# Altium project FOB(3).PrjPcb
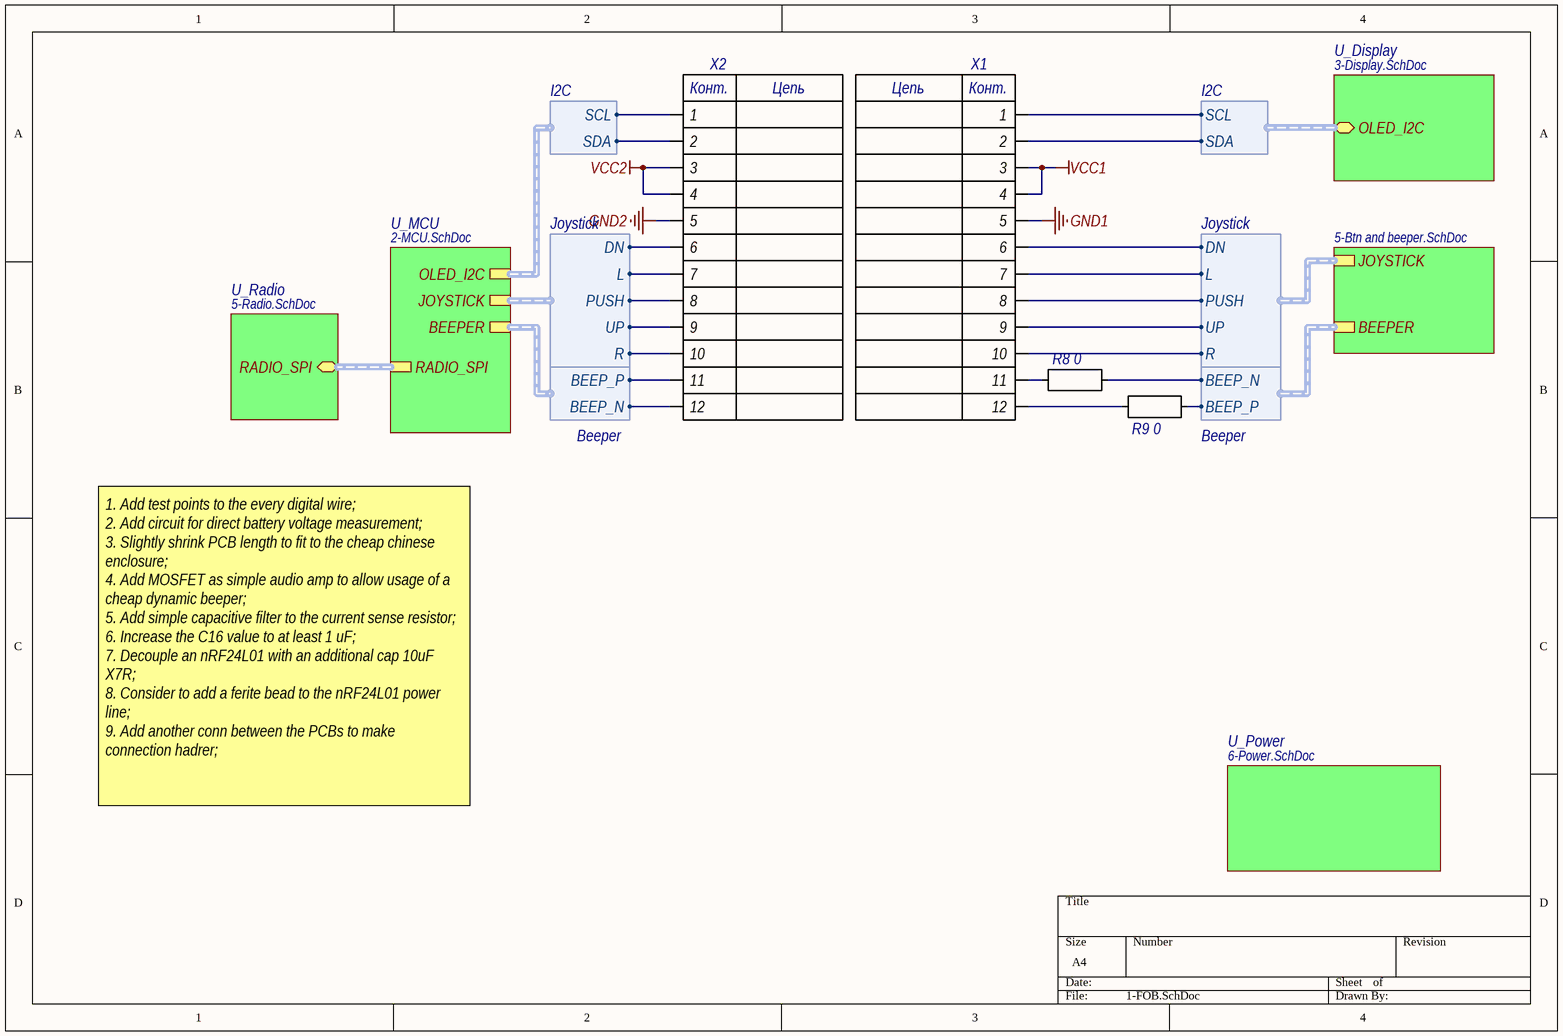
[diagram p0: 1-FOB.SchDoc]
6 sheets, 50 parts. Net scope: hierarchical (ports join the sheet entries above them; power ports are global).
Board file: FOB.PcbDoc
Sheets:
  1-FOB.SchDoc
    U_Radio = 5-Radio.SchDoc
    U_Display = 3-Display.SchDoc
    U_Btn and beeper = 5-Btn and beeper.SchDoc
    U_Power = 6-Power.SchDoc
    U_MCU = 2-MCU.SchDoc

## Sheet 1-FOB.SchDoc
size A4

### Parts
R8  value 0  [CHIP_0402_R]  (hidden comment: Резистор)
R9  value 0  [CHIP_0402_R]  (hidden comment: Резистор)
X1  PLD-12  [PLD1.27-12 SMD]  (value not drawn)
X2  PBD-12  [PBD1.27-12 SMD]  (value not drawn)

### Sub-sheets
U_Btn and beeper = 5-Btn and beeper.SchDoc: JOYSTICK (harness Joystick), BEEPER (harness Beeper)
U_Display = 3-Display.SchDoc: OLED_I2C (harness I2C)
U_MCU = 2-MCU.SchDoc: JOYSTICK (harness Joystick), BEEPER (harness Beeper), OLED_I2C (harness I2C), RADIO_SPI (harness RADIO_SPI)
U_Power = 6-Power.SchDoc: no entries
U_Radio = 5-Radio.SchDoc: RADIO_SPI (harness RADIO_SPI)

### Harnesses
Joystick: UP, DN, L, R, PUSH
Beeper: BEEP_P, BEEP_N
I2C: SCL, SDA
Joystick: DN, L, PUSH, R, UP

### Nets
GND1: X1.5
GND2: X2.5
VCC1: X1.3 X1.4
VCC2: X2.3 X2.4
PUSH: X2.8 ; sheet U_MCU/JOYSTICK.PUSH
SCL: X2.1 ; sheet U_MCU/OLED_I2C.SCL
SDA: X2.2 ; sheet U_MCU/OLED_I2C.SDA
SW_DN: X1.6 ; sheet U_Btn and beeper/JOYSTICK.DN
SW_L: X1.7 ; sheet U_Btn and beeper/JOYSTICK.L
SW_PUSH: X1.8 ; sheet U_Btn and beeper/JOYSTICK.PUSH
SW_R: X1.10 ; sheet U_Btn and beeper/JOYSTICK.R
SW_UP: X1.9 ; sheet U_Btn and beeper/JOYSTICK.UP
NetBQ1_1: R9.2 ; sheet U_Btn and beeper/BEEPER.BEEP_P
NetBQ1_2: R8.2 ; sheet U_Btn and beeper/BEEPER.BEEP_N
NetDD1_6: X2.9 ; sheet U_MCU/JOYSTICK.UP
NetDD1_7: X2.7 ; sheet U_MCU/JOYSTICK.L
NetDD1_8: X2.6 ; sheet U_MCU/JOYSTICK.DN
NetDD1_9: X2.10 ; sheet U_MCU/JOYSTICK.R
NetDD1_18: X2.11 ; sheet U_MCU/BEEPER.BEEP_P
NetDD1_19: X2.12 ; sheet U_MCU/BEEPER.BEEP_N
NetHG1_18: X1.1 ; sheet U_Display/OLED_I2C.SCL
NetHG1_19: X1.2 ; sheet U_Display/OLED_I2C.SDA
NetR8_1: R8.1 X1.11
NetR9_1: R9.1 X1.12

### Buses and harness runs
harness sheet U_MCU/RADIO_SPI = sheet U_Radio/RADIO_SPI

### Notes on the sheet
- 1. Add test points to the every digital wire;
  2. Add circuit for direct battery voltage measurement;
  3. Slightly shrink PCB length to fit to the cheap chinese enclosure;
  4. Add MOSFET as simple audio amp to allow usage of a cheap dynamic beeper;
  5. Add simple capacitive filter to the current sense resistor;
  6. Increase the C16 value to at least 1 uF;
  7. Decouple an nRF24L01 with an additional cap 10uF X7R;
  8. Consider to add a ferite bead to the nRF24L01 power line;
  9. Add another conn between the PCBs to make connection hadrer;
- (in symbol PBD-12) Конт.; Цепь
- (in symbol PLD-12) Цепь; Конт.

### Library data of the parts
R8 R9 = Резистор: PartNumber: RC0402JR-070RL; Mfg: YAGEO
X1 = PLD-12: PartNumber: PLLD1.27-80 (2X40) SMD
X2 = PBD-12: PartNumber: PBD1.27-12 (2X06) SMD

## Sheet 5-Radio.SchDoc
size A4
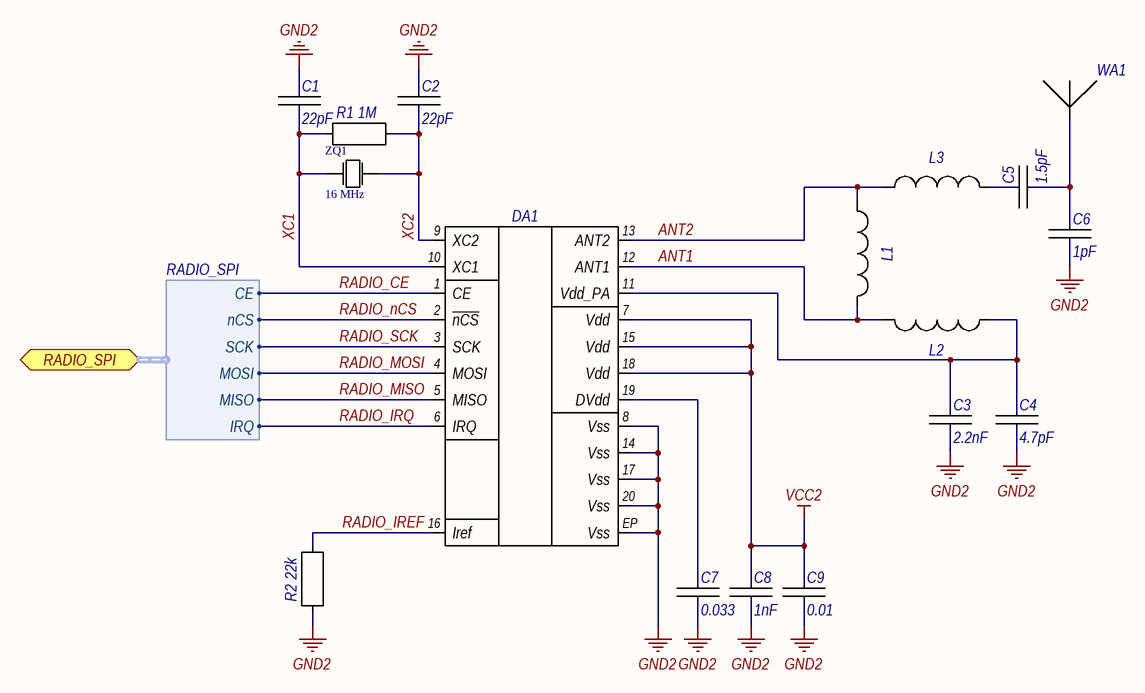
[diagram p1: 5-Radio.SchDoc]

### Parts
C1  value 22pF  [CHIP_0402_C]  (hidden comment: Конденсатор)
C2  value 22pF  [CHIP_0402_C]  (hidden comment: Конденсатор)
C3  value 2.2nF  [CHIP_0402_C]  (hidden comment: Конденсатор)
C4  value 4.7pF  [CHIP_0402_C]  (hidden comment: Конденсатор)
C5  value 1.5pF  [CHIP_0402_C]  (hidden comment: Конденсатор)
C6  value 1pF  [CHIP_0402_C]  (hidden comment: Конденсатор)
C7  value 0.033  [CHIP_0402_C]  (hidden comment: Конденсатор)
C8  value 1nF  [CHIP_0402_C]  (hidden comment: Конденсатор)
C9  value 0.01  [CHIP_0402_C]  (hidden comment: Конденсатор)
DA1  nRF24L01+  [QFN-20 - DIY]  (value not drawn)
L1  Дроссель  [CHIP_0402_L]  (value not drawn)
L2  Дроссель  [CHIP_0402_L]  (value not drawn)
L3  Дроссель  [CHIP_0402_L]  (value not drawn)
R1  value 1M  [CHIP_0402_R]  (hidden comment: Резистор)
R2  value 22k  [CHIP_0402_R]  (hidden comment: Резистор)
WA1  Antenna  [ANTENNA PCB 2.4]  (value not drawn)  (net tie, no BOM)
ZQ1  16 MHz  [HC-49SM]

### Ports
RADIO_SPI (harness RADIO_SPI)

### Harnesses
RADIO_SPI: CE, nCS, SCK, MOSI, MISO, IRQ

### Nets
GND2: C1.2 C2.2 C3.1 C4.1 C6.1 C7.1 C8.1 C9.1 DA1.8(Vss) DA1.14(Vss) DA1.17(Vss) DA1.20(Vss) DA1.EP(Vss) R2.1
VCC2: C8.2 C9.2 DA1.7(Vdd) DA1.15(Vdd) DA1.18(Vdd)
ANT1: DA1.12(ANT1) L1.1 L2.2
ANT2: DA1.13(ANT2) L1.2 L3.2
RADIO_CE: DA1.1(CE) ; port RADIO_SPI.CE
RADIO_IREF: DA1.16(Iref) R2.2
RADIO_IRQ: DA1.6(IRQ) ; port RADIO_SPI.IRQ
RADIO_MISO: DA1.5(MISO) ; port RADIO_SPI.MISO
RADIO_MOSI: DA1.4(MOSI) ; port RADIO_SPI.MOSI
RADIO_nCS: DA1.2(~{nCS}) ; port RADIO_SPI.nCS
RADIO_SCK: DA1.3(SCK) ; port RADIO_SPI.SCK
XC1: C1.1 DA1.10(XC1) R1.1 ZQ1.1
XC2: C2.1 DA1.9(XC2) R1.2 ZQ1.2
NetC3_2: C3.2 C4.2 DA1.11(Vdd_PA) L2.1
NetC5_1: C5.1 C6.2 WA1.1
NetC5_2: C5.2 L3.1
NetC7_2: C7.2 DA1.19(DVdd)

### Library data of the parts
C1 C2 = Конденсатор: PartNumber: CC0402JRNPO9BN220; Mfg: YAGEO
C3 = Конденсатор: PartNumber: GRM155R71H222KA01D; Mfg: MURATA
C4 = Конденсатор: PartNumber: CC0402BRNPO9BN4R7; Mfg: YAGEO
C5 = Конденсатор: PartNumber: CC0402CRNPO9BN1R5; Mfg: YAGEO
C6 = Конденсатор: PartNumber: CC0402BRNPO9BNR50; Mfg: YAGEO
C7 = Конденсатор: PartNumber: CC0402KRX7R7BB333; Mfg: YAGEO
C8 = Конденсатор: PartNumber: CC0402JRNPO9BN102; Mfg: YAGEO
C9 = Конденсатор: PartNumber: CC0402KRX7R9BB103; Mfg: YAGEO
DA1 = nRF24L01+: RF, 2.4 GHz Transceiver; Mfg: NORDIC SEMI; PartNumber: nRF24L01+
L1 = Дроссель: PartNumber: LQW15AN8N2G00D; Mfg: MURATA; Value: 8.2nH
L2 = Дроссель: PartNumber: LQG15HS27NJ02D; Mfg: MURATA; Value: 2.7nH
L3 = Дроссель: PartNumber: LQG15HN3N9S02D; Mfg: MURATA; Value: 3.9nH
R1 = Резистор: PartNumber: RC0402FR-071ML; Mfg: YAGEO
R2 = Резистор: PartNumber: RC0402FR-0722KL; Mfg: YAGEO
ZQ1 = XTAL_2pin: Осциллятор, 2 вывода; PartNumber: 16000 KHz HC-49/US; Type: MG3A; Value: 16 MHz

## Sheet 3-Display.SchDoc
size A4
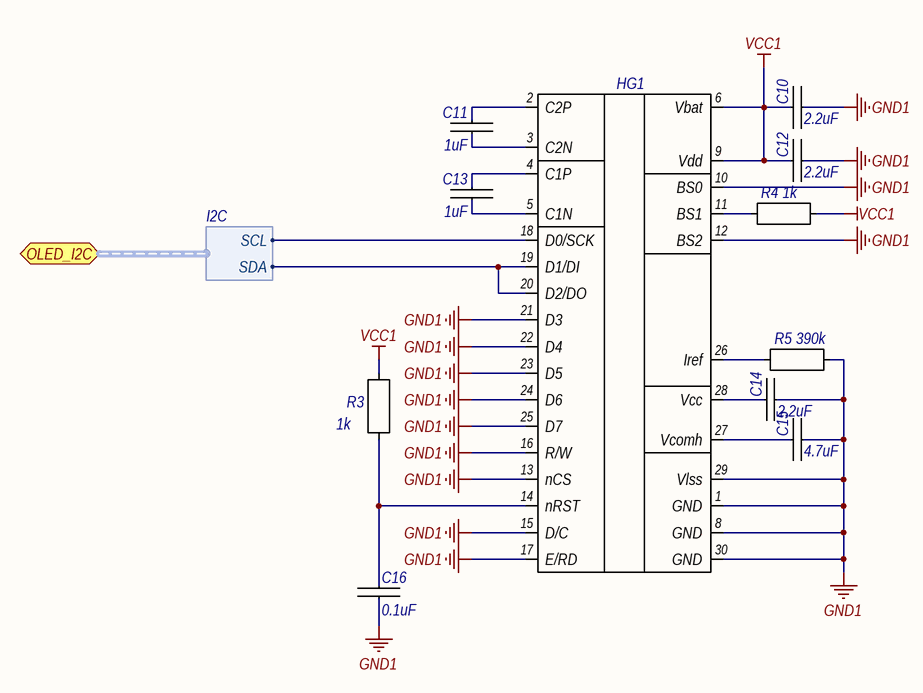
[diagram p2: 3-Display.SchDoc]

### Parts
C10  value 2.2uF  [CHIP_0402_C]  (hidden comment: Конденсатор)
C11  value 1uF  [CHIP_0402_C]  (hidden comment: Конденсатор)
C12  value 2.2uF  [CHIP_0402_C]  (hidden comment: Конденсатор)
C13  value 1uF  [CHIP_0402_C]  (hidden comment: Конденсатор)
C14  value 2.2uF  [CHIP_0402_C]  (hidden comment: Конденсатор)
C15  value 4.7uF  [CHIP_0402_C]  (hidden comment: Конденсатор)
C16  value 0.1uF  [CHIP_0402_C]  (hidden comment: Конденсатор)
HG1  OLED 0,96  [OLED 0.96]  (value not drawn)
R3  value 1k  [CHIP_0402_R]  (hidden comment: Резистор)
R4  value 1k  [CHIP_0402_R]  (hidden comment: Резистор)
R5  value 390k  [CHIP_0402_R]  (hidden comment: Резистор)

### Ports
OLED_I2C (harness I2C)

### Harnesses
I2C: SCL, SDA

### Nets
GND1: C10.1 C12.1 C14.1 C15.1 C16.1 HG1.1(GND) HG1.8(GND) HG1.10(BS0) HG1.12(BS2) HG1.13(nCS) HG1.15(D/C) HG1.16(R/W) HG1.17(E/RD) HG1.21(D3) HG1.22(D4) HG1.23(D5) HG1.24(D6) HG1.25(D7) HG1.29(Vlss) HG1.30(GND) R5.2
VCC1: C10.2 C12.2 HG1.6(Vbat) HG1.9(Vdd) R3.2 R4.2
NetC11_1: C11.1 HG1.3(C2N)
NetC11_2: C11.2 HG1.2(C2P)
NetC13_1: C13.1 HG1.5(C1N)
NetC13_2: C13.2 HG1.4(C1P)
NetC14_2: C14.2 HG1.28(Vcc)
NetC15_2: C15.2 HG1.27(Vcomh)
NetC16_2: C16.2 HG1.14(nRST) R3.1
NetHG1_11: HG1.11(BS1) R4.1
NetHG1_18: HG1.18(D0/SCK) ; port OLED_I2C.SCL
NetHG1_19: HG1.19(D1/DI) HG1.20(D2/DO) ; port OLED_I2C.SDA
NetHG1_26: HG1.26(Iref) R5.1

### Library data of the parts
C10 C12 C14 = Конденсатор: PartNumber: GRM155R61A225KE95D; Mfg: MURATA
C11 C13 = Конденсатор: PartNumber: CC0402KRX5R5BB105; Mfg: YAGEO
C15 = Конденсатор: PartNumber: GRM155R60J475ME87D; Mfg: MURATA
C16 = Конденсатор: PartNumber: CC0402KRX7R7BB104; Mfg: YAGEO
HG1 = OLED 0,96: OLED, Serial, 0.96"; PartNumber: SSD1306 OLED Module; Mfg: *
R3 R4 = Резистор: PartNumber: RC0402FR-071KL; Mfg: YAGEO
R5 = Резистор: PartNumber: RC0402FR-07390KL; Mfg: YAGEO

## Sheet 5-Btn and beeper.SchDoc
size A4
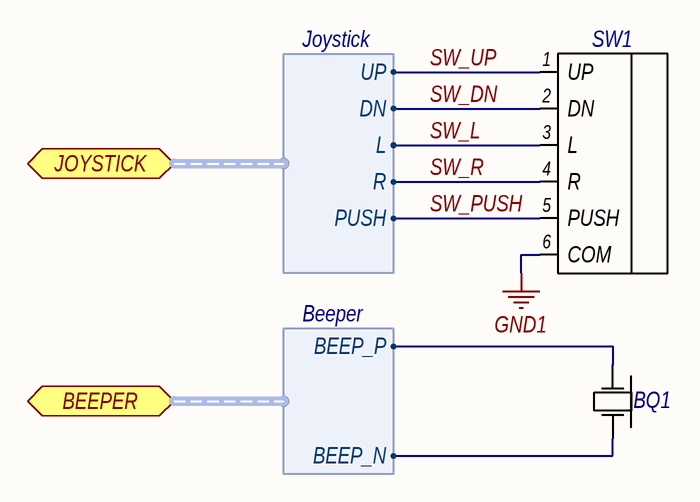
[diagram p3: 5-Btn and beeper.SchDoc]

### Parts
BQ1  TFM-25B  [CST-931RP-A]  (value not drawn)
SW1  Joystick  [jOYSTICK_sam]  (value not drawn)

### Ports
BEEPER (harness Beeper), JOYSTICK (harness Joystick)

### Harnesses
Joystick: UP, DN, L, R, PUSH
Beeper: BEEP_P, BEEP_N

### Nets
GND1: SW1.6(COM)
SW_DN: SW1.2(DN) ; port JOYSTICK.DN
SW_L: SW1.3(L) ; port JOYSTICK.L
SW_PUSH: SW1.5(PUSH) ; port JOYSTICK.PUSH
SW_R: SW1.4(R) ; port JOYSTICK.R
SW_UP: SW1.1(UP) ; port JOYSTICK.UP
NetBQ1_1: BQ1.1 ; port BEEPER.BEEP_P
NetBQ1_2: BQ1.2 ; port BEEPER.BEEP_N

### Library data of the parts
BQ1 = Пьезоизлучатель TFM-25B: PartNumber: CST-931RP-A
SW1 = Joystick: Joystick, 4-dir+push; PartNumber: Custom

## Sheet 6-Power.SchDoc
size A4
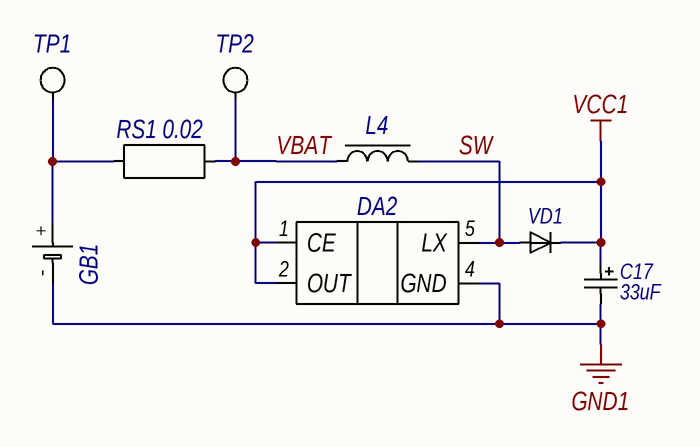
[diagram p4: 6-Power.SchDoc]

### Parts
C17  33uF  [CAP_TYPE_A]
DA2  NCP1400A  [SOT23-5]  (value not drawn)
GB1  Battery  [AAA Holder_1]  (value not drawn)
L4  (no value)  [SRN5040]
RS1  value 0.02  [CHIP_0805_R]  (hidden comment: Резистор)  (no BOM)
TP1  TEST_POINT  [Pad_1]  (value not drawn)  (no BOM)
TP2  TEST_POINT  [Pad_1]  (value not drawn)  (no BOM)
VD1  STPS0520Z  [SOD123]  (value not drawn)

### Nets
GND1: C17.2 DA2.4(GND) GB1.-
VCC1: C17.1 DA2.1(CE) DA2.2(OUT) VD1.K
SW: DA2.5(LX) L4.2 VD1.A
VBAT: L4.1 RS1.2 TP2.1
NetGB1_+: GB1.+ RS1.1 TP1.1

### Library data of the parts
C17 = C_POL: Конденсатор полярный; PartNumber: T491A336K006AT; Voltage, V: *; Tolerance, %: *; Value: 33uF
DA2 = NCP1400A: PSIC, Low-Power Step-Up Converter; Mfg: ONS; PartNumber: NCP1400A
GB1 = Battery: PartNumber: Custom
L4 = Ind_core: Дроссель с сердечником; PartNumber: VLCF4028T-220MR72-2; Mfg: TDK
RS1 = Резистор: PartNumber: 0R02 0.5%; Mfg: *
VD1 = Diode: Диод; Mfg: ST; PartNumber: STPS0520Z

## Sheet 2-MCU.SchDoc
size A4
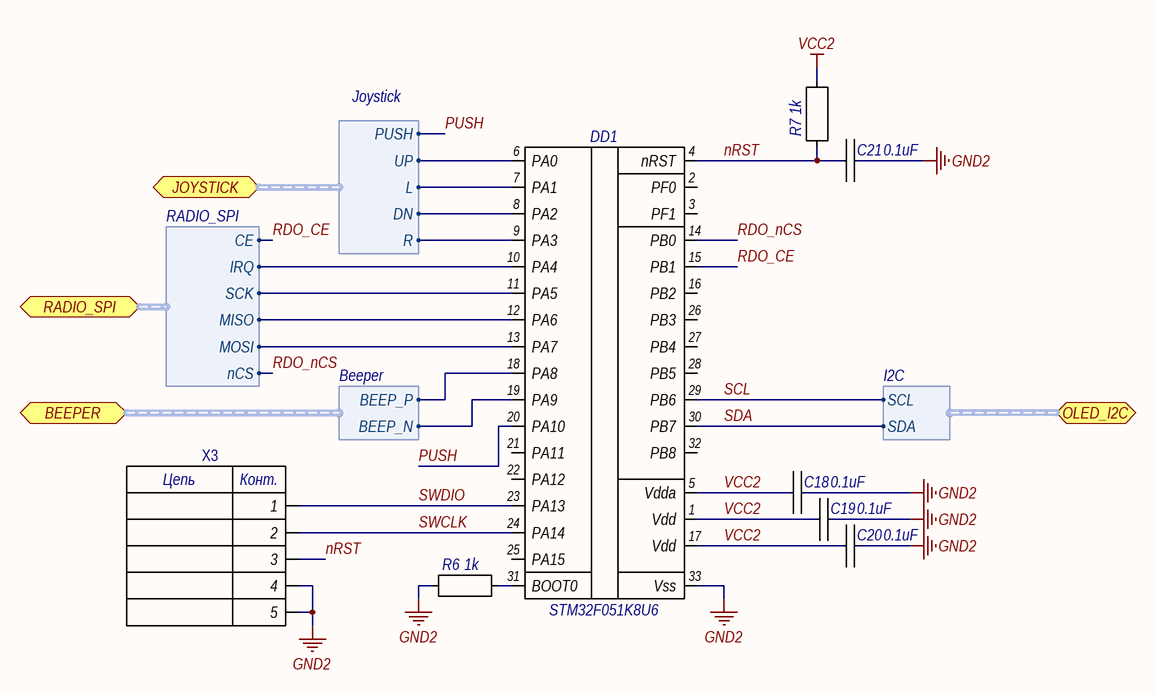
[diagram p5: 2-MCU.SchDoc]

### Parts
C18  value 0.1uF  [CHIP_0402_C]  (hidden comment: Конденсатор)
C19  value 0.1uF  [CHIP_0402_C]  (hidden comment: Конденсатор)
C20  value 0.1uF  [CHIP_0402_C]  (hidden comment: Конденсатор)
C21  value 0.1uF  [CHIP_0402_C]  (hidden comment: Конденсатор)
DD1  PartNumber: STM32F051K8U6  [UFQFPN32]  (hidden comment: STM32F0xx_32)
R6  value 1k  [CHIP_0402_R]  (hidden comment: Резистор)
R7  value 1k  [CHIP_0402_R]  (hidden comment: Резистор)
X3  SWD for STM32  [STM32 SWD-4]  (value not drawn)  (no BOM)

### Ports
BEEPER (harness Beeper), JOYSTICK (harness Joystick), OLED_I2C (harness I2C), RADIO_SPI (harness RADIO_SPI)

### Harnesses
Joystick: UP, DN, L, R, PUSH
Beeper: BEEP_P, BEEP_N
I2C: SCL, SDA
RADIO_SPI: CE, nCS, SCK, MOSI, MISO, IRQ

### Nets
GND2: C18.1 C19.1 C20.1 C21.1 DD1.33(Vss) R6.1 X3.4 X3.5
VCC2: C18.2 C19.2 C20.2 DD1.1(Vdd) DD1.5(Vdda) DD1.17(Vdd) R7.2
nRST: C21.2 DD1.4(nRST) R7.1 X3.3
PUSH: DD1.20(PA10) ; port JOYSTICK.PUSH
RADIO_IRQ: DD1.10(PA4) ; port RADIO_SPI.IRQ
RADIO_MISO: DD1.12(PA6) ; port RADIO_SPI.MISO
RADIO_MOSI: DD1.13(PA7) ; port RADIO_SPI.MOSI
RADIO_SCK: DD1.11(PA5) ; port RADIO_SPI.SCK
RDO_CE: DD1.15(PB1) ; port RADIO_SPI.CE  [project net RADIO_CE]
RDO_nCS: DD1.14(PB0) ; port RADIO_SPI.nCS  [project net RADIO_nCS]
SCL: DD1.29(PB6) ; port OLED_I2C.SCL
SDA: DD1.30(PB7) ; port OLED_I2C.SDA
SWCLK: DD1.24(PA14) X3.2
SWDIO: DD1.23(PA13) X3.1
NetDD1_6: DD1.6(PA0) ; port JOYSTICK.UP
NetDD1_7: DD1.7(PA1) ; port JOYSTICK.L
NetDD1_8: DD1.8(PA2) ; port JOYSTICK.DN
NetDD1_9: DD1.9(PA3) ; port JOYSTICK.R
NetDD1_18: DD1.18(PA8) ; port BEEPER.BEEP_P
NetDD1_19: DD1.19(PA9) ; port BEEPER.BEEP_N
NetDD1_31: DD1.31(BOOT0) R6.2

Not connected (* = marked no-connect by the designer): DD1 2(PF0) 3(PF1) 16(PB2) 21(PA11) 22(PA12) 25(PA15) 26(PB3) 27(PB4) 28(PB5) 32(PB8)

### Notes on the sheet
- (in symbol SWD_STM32) Цепь; Конт.

### Library data of the parts
C18-C21 = Конденсатор: as C16 on sheet 3-Display
DD1 = STM32F0xx_32: MCU, 32-leaded; Mfg: ST
R6 R7 = Резистор: PartNumber: RC0402FR-071KL; Mfg: YAGEO
X3 = SWD_STM32: Конт. площадки для подключения SWD; pin to pad: 5>4

## Nets that join several sheets
GND1: 1-FOB (X1.5), 3-Display (21 pins), 5-Btn and beeper (SW1.6), 6-Power (C17.2 DA2.4 GB1.-)
GND2: 1-FOB (X2.5), 5-Radio (14 pins), 2-MCU (8 pins)
VCC1: 1-FOB (X1.3 X1.4), 3-Display (6 pins), 6-Power (C17.1 DA2.1 DA2.2 VD1.K)
VCC2: 1-FOB (X2.3 X2.4), 5-Radio (5 pins), 2-MCU (7 pins)
NetBQ1_1: 1-FOB (R9.2), 5-Btn and beeper (BQ1.1)
NetBQ1_2: 1-FOB (R8.2), 5-Btn and beeper (BQ1.2)
NetDD1_6: 1-FOB (X2.9), 2-MCU (DD1.6)
NetDD1_7: 1-FOB (X2.7), 2-MCU (DD1.7)
NetDD1_8: 1-FOB (X2.6), 2-MCU (DD1.8)
NetDD1_9: 1-FOB (X2.10), 2-MCU (DD1.9)
NetDD1_18: 1-FOB (X2.11), 2-MCU (DD1.18)
NetDD1_19: 1-FOB (X2.12), 2-MCU (DD1.19)
NetHG1_18: 1-FOB (X1.1), 3-Display (HG1.18)
NetHG1_19: 1-FOB (X1.2), 3-Display (HG1.19 HG1.20)
PUSH: 1-FOB (X2.8), 2-MCU (DD1.20)
RADIO_CE: 5-Radio (DA1.1), 2-MCU (DD1.15)
RADIO_IRQ: 5-Radio (DA1.6), 2-MCU (DD1.10)
RADIO_MISO: 5-Radio (DA1.5), 2-MCU (DD1.12)
RADIO_MOSI: 5-Radio (DA1.4), 2-MCU (DD1.13)
RADIO_nCS: 5-Radio (DA1.2), 2-MCU (DD1.14)
RADIO_SCK: 5-Radio (DA1.3), 2-MCU (DD1.11)
SCL: 1-FOB (X2.1), 2-MCU (DD1.29)
SDA: 1-FOB (X2.2), 2-MCU (DD1.30)
SW_DN: 1-FOB (X1.6), 5-Btn and beeper (SW1.2)
SW_L: 1-FOB (X1.7), 5-Btn and beeper (SW1.3)
SW_PUSH: 1-FOB (X1.8), 5-Btn and beeper (SW1.5)
SW_R: 1-FOB (X1.10), 5-Btn and beeper (SW1.4)
SW_UP: 1-FOB (X1.9), 5-Btn and beeper (SW1.1)